# EAGLE design SubBoard_V1 (EAGLE 9.5.2)

## Sheet 1 of 2
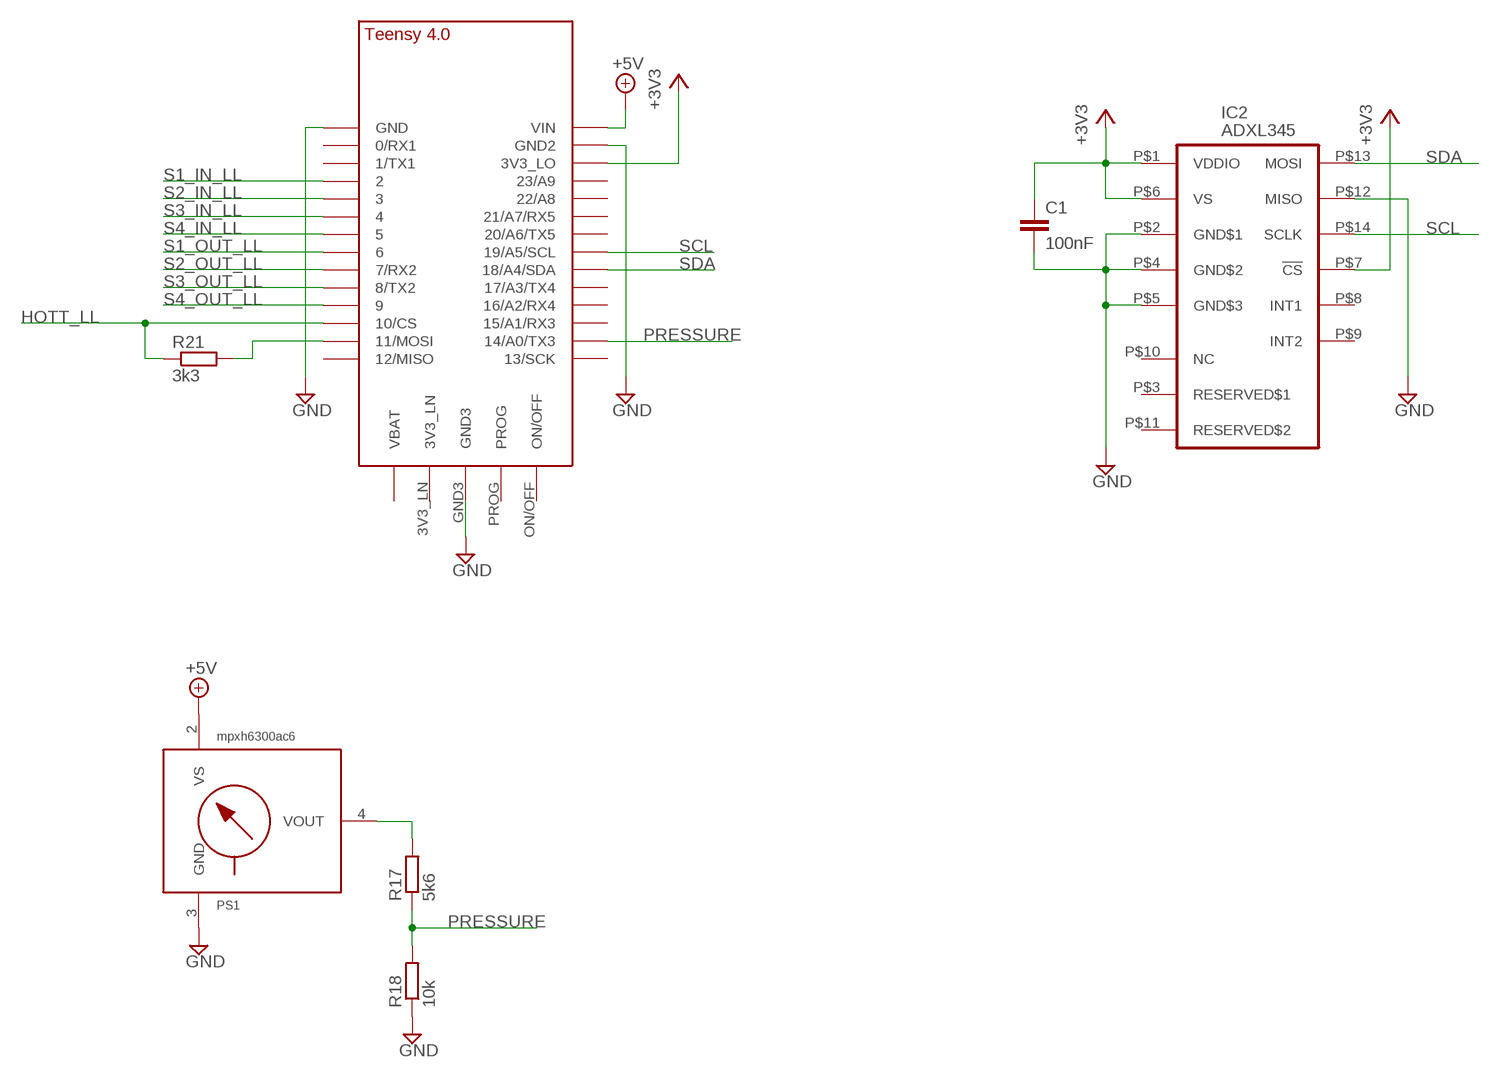
[diagram p0: schematic, sheet 1]

### Parts
C1  100nF  C-EUC0805  [C0805]
IC2  ADXL345  [LGA14]
M1  TEENSY_4.0-BASIC  [TEENSY_4.0-BASIC]
PS1  mpxh6300ac6  MPXV5004GC6U  [482A]
R17  5k6  R-EU_R0805  [R0805]
R18  10k  R-EU_R0805  [R0805]
R21  3k3  R-EU_R0805  [R0805]

### Nets
+3V3: C1.1 IC2.P$1(VDDIO) IC2.P$6(VS) IC2.P$7(!CS) M1.3V3_LO ; also sheet 2
+5V: M1.VIN PS1.2(VS) ; also sheet 2
GND: C1.2 IC2.P$2(GND$1) IC2.P$4(GND$2) IC2.P$5(GND$3) IC2.P$12(MISO) M1.GND M1.GND2 M1.GND3 PS1.3(GND) R18.1 ; also sheet 2
HOTT_LL: M1.10/CS R21.1 ; also sheet 2
N$1: PS1.4(VOUT) R17.2
N$3: M1.11/MOSI R21.2
PRESSURE: M1.14/A0(14/A0/TX3) R17.1 R18.2
S1_IN_LL: M1.2 ; also sheet 2
S1_OUT_LL: M1.6 ; also sheet 2
S2_IN_LL: M1.3/CANTX ; also sheet 2
S2_OUT_LL: M1.7(7/RX2) ; also sheet 2
S3_IN_LL: M1.4/CANRX ; also sheet 2
S3_OUT_LL: M1.8(8/TX2) ; also sheet 2
S4_IN_LL: M1.5 ; also sheet 2
S4_OUT_LL: M1.9/CS ; also sheet 2
SCL: IC2.P$14(SCLK) M1.19/A5/SCL
SDA: IC2.P$13(MOSI) M1.18/A4/SDA
Unconnected: IC2.P$3(RESERVED$1) IC2.P$8(INT1) IC2.P$9(INT2) IC2.P$10(NC) IC2.P$11(RESERVED$2) M1.0/RX(0/RX1) M1.1/TX(1/TX1) M1.3V3_LN M1.12/MISO M1.13/SCK M1.15/A1(15/A1/RX3) M1.16/A2(16/A2/RX4) M1.17/A3(17/A3/TX4) M1.20/A6(20/A6/TX5) M1.21/A7(21/A7/RX5) M1.22/A8 M1.23/A9 M1.ON/OFF M1.PROG M1.VBAT\(VBAT) PS1.1(NC) PS1.5(NC) PS1.6(NC)

## Sheet 2 of 2
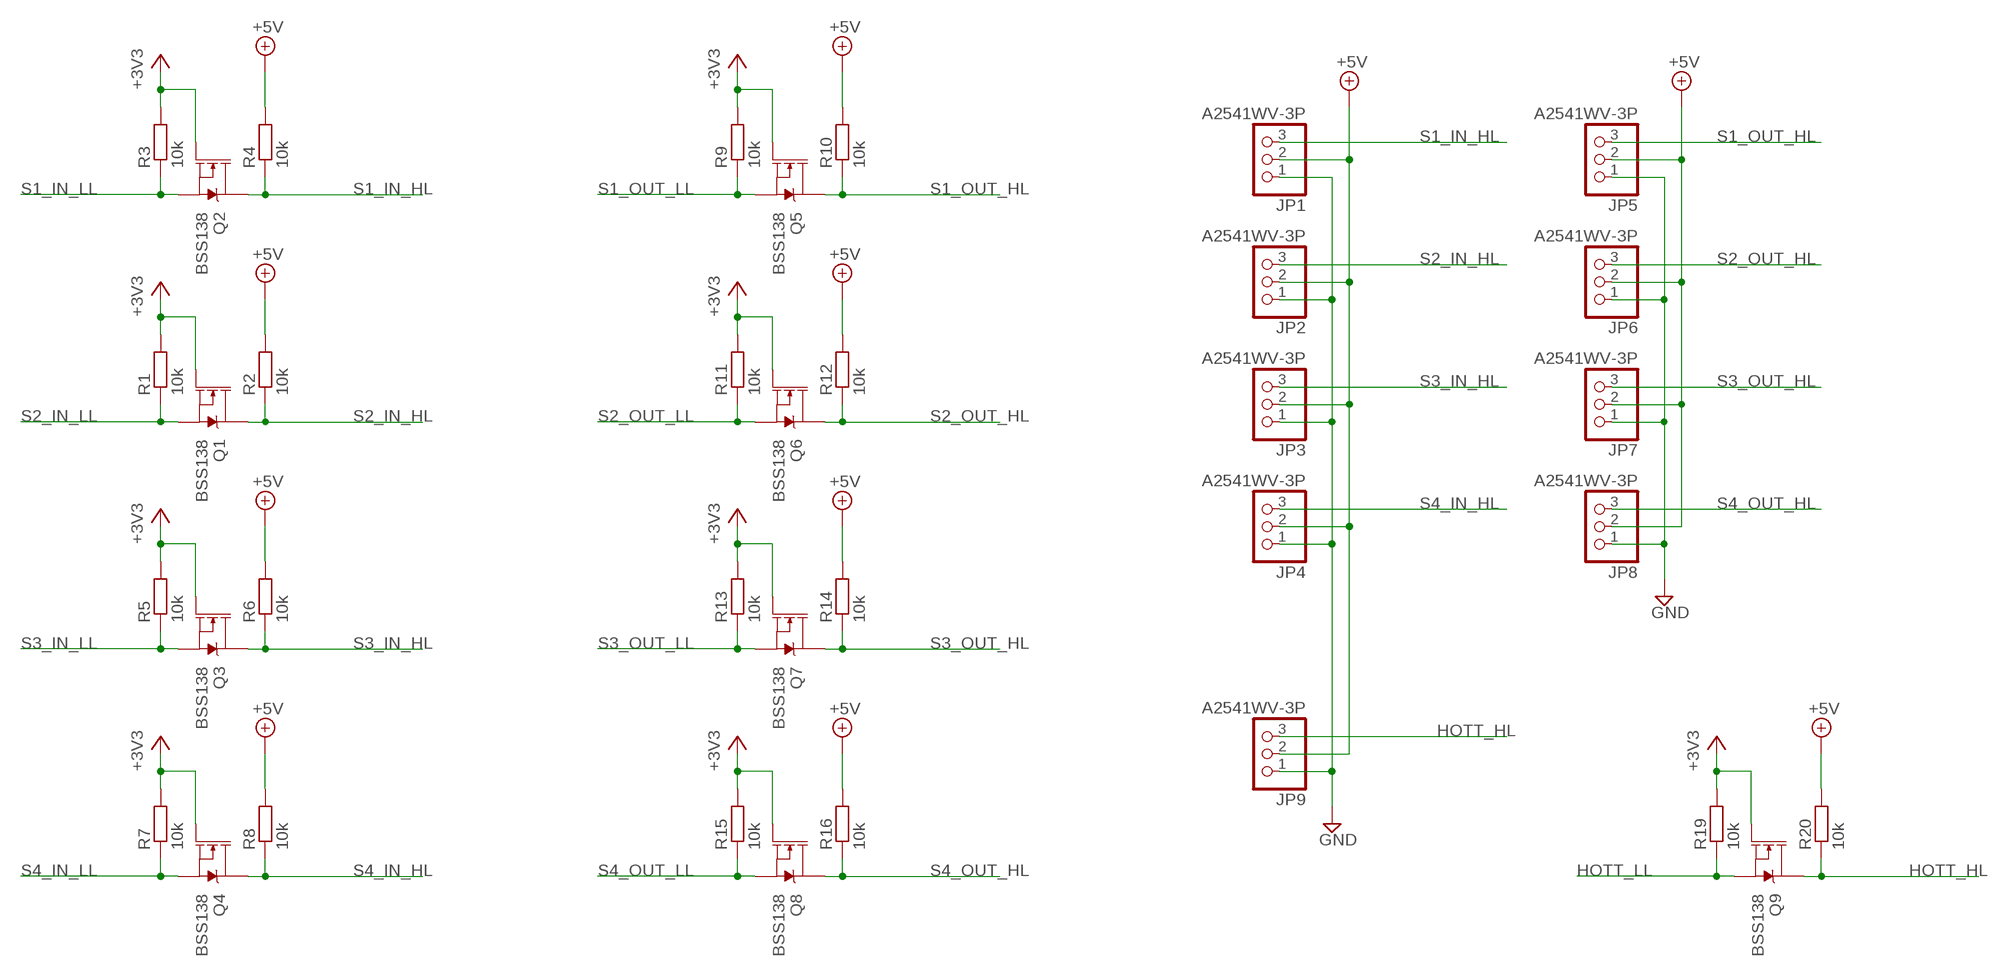
[diagram p1: schematic, sheet 2]

### Parts
JP1  A2541WV-3P  PINHD-1X3  [1X03]
JP2  A2541WV-3P  PINHD-1X3  [1X03]
JP3  A2541WV-3P  PINHD-1X3  [1X03]
JP4  A2541WV-3P  PINHD-1X3  [1X03]
JP5  A2541WV-3P  PINHD-1X3  [1X03]
JP6  A2541WV-3P  PINHD-1X3  [1X03]
JP7  A2541WV-3P  PINHD-1X3  [1X03]
JP8  A2541WV-3P  PINHD-1X3  [1X03]
JP9  A2541WV-3P  PINHD-1X3  [1X03]
Q1  BSS138  MOSFET-NCH-BSS138  [SOT23-3]
Q2  BSS138  MOSFET-NCH-BSS138  [SOT23-3]
Q3  BSS138  MOSFET-NCH-BSS138  [SOT23-3]
Q4  BSS138  MOSFET-NCH-BSS138  [SOT23-3]
Q5  BSS138  MOSFET-NCH-BSS138  [SOT23-3]
Q6  BSS138  MOSFET-NCH-BSS138  [SOT23-3]
Q7  BSS138  MOSFET-NCH-BSS138  [SOT23-3]
Q8  BSS138  MOSFET-NCH-BSS138  [SOT23-3]
Q9  BSS138  MOSFET-NCH-BSS138  [SOT23-3]
R1  10k  R-EU_R0603  [R0603]
R2  10k  R-EU_R0603  [R0603]
R3  10k  R-EU_R0603  [R0603]
R4  10k  R-EU_R0603  [R0603]
R5  10k  R-EU_R0603  [R0603]
R6  10k  R-EU_R0603  [R0603]
R7  10k  R-EU_R0603  [R0603]
R8  10k  R-EU_R0603  [R0603]
R9  10k  R-EU_R0603  [R0603]
R10  10k  R-EU_R0603  [R0603]
R11  10k  R-EU_R0603  [R0603]
R12  10k  R-EU_R0603  [R0603]
R13  10k  R-EU_R0603  [R0603]
R14  10k  R-EU_R0603  [R0603]
R15  10k  R-EU_R0603  [R0603]
R16  10k  R-EU_R0603  [R0603]
R19  10k  R-EU_R0603  [R0603]
R20  10k  R-EU_R0603  [R0603]

### Nets
+3V3: Q1.1(G) Q2.1(G) Q3.1(G) Q4.1(G) Q5.1(G) Q6.1(G) Q7.1(G) Q8.1(G) Q9.1(G) R1.2 R3.2 R5.2 R7.2 R9.2 R11.2 R13.2 R15.2 R19.2 ; also sheet 1
+5V: JP1.2 JP2.2 JP3.2 JP4.2 JP5.2 JP6.2 JP7.2 JP8.2 JP9.2 R2.2 R4.2 R6.2 R8.2 R10.2 R12.2 R14.2 R16.2 R20.2 ; also sheet 1
GND: JP1.1 JP2.1 JP3.1 JP4.1 JP5.1 JP6.1 JP7.1 JP8.1 JP9.1 ; also sheet 1
HOTT_HL: JP9.3 Q9.3(D) R20.1
HOTT_LL: Q9.2(S) R19.1 ; also sheet 1
S1_IN_HL: JP1.3 Q2.3(D) R4.1
S1_IN_LL: Q2.2(S) R3.1 ; also sheet 1
S1_OUT_HL: JP5.3 Q5.3(D) R10.1
S1_OUT_LL: Q5.2(S) R9.1 ; also sheet 1
S2_IN_HL: JP2.3 Q1.3(D) R2.1
S2_IN_LL: Q1.2(S) R1.1 ; also sheet 1
S2_OUT_HL: JP6.3 Q6.3(D) R12.1
S2_OUT_LL: Q6.2(S) R11.1 ; also sheet 1
S3_IN_HL: JP3.3 Q3.3(D) R6.1
S3_IN_LL: Q3.2(S) R5.1 ; also sheet 1
S3_OUT_HL: JP7.3 Q7.3(D) R14.1
S3_OUT_LL: Q7.2(S) R13.1 ; also sheet 1
S4_IN_HL: JP4.3 Q4.3(D) R8.1
S4_IN_LL: Q4.2(S) R7.1 ; also sheet 1
S4_OUT_HL: JP8.3 Q8.3(D) R16.1
S4_OUT_LL: Q8.2(S) R15.1 ; also sheet 1

## Library data of the parts
C1 = rcl:C-EU: CAPACITOR, European symbol; SPICEPREFIX: C
IC2 = adxl345:ADXL345: 3-Axis, ±2 g/±4 g/±8 g/±16 g Digital Accelerometer
JP1-JP9 = pinhead:PINHD-1X3: PIN HEADER
M1 = Teensy-4.0:TEENSY_4.0-BASIC
PS1 = mpx-freescale:MPXV5004G: Integrated Silicon Pressure Sensor On-Chip Signal Conditioned, Temperature Compensated and Calibrated INTEGRATED PRESSURE SENSOR 0 TO 3.92 kPA (0 TO 400 mm H2O) 1.0 TO 4.9 V OUTPUT
Q1-Q9 = SparkFun-DiscreteSemi:MOSFET-NCH: N-channel MOSFETs Voltage controlled devices that allow control of high current outputs. SparkFun Products: SparkFun OpenScale <https://www.sparkfun.com/products/13261> SparkFun Digital Sandbox <https://www.sparkfun.com/products/12651> SparkFun Monster Moto Shield <https://www.sparkfun.com/products/10182> SparkFun MOSFET Power Controller <https://www.sparkfun.com/products/11214>; PROD_ID: TRANS-00830; VALUE: 220mA/50V/3.5Ω
R1-R21 = rcl:R-EU_: RESISTOR, European symbol; SPICEPREFIX: R

## Board
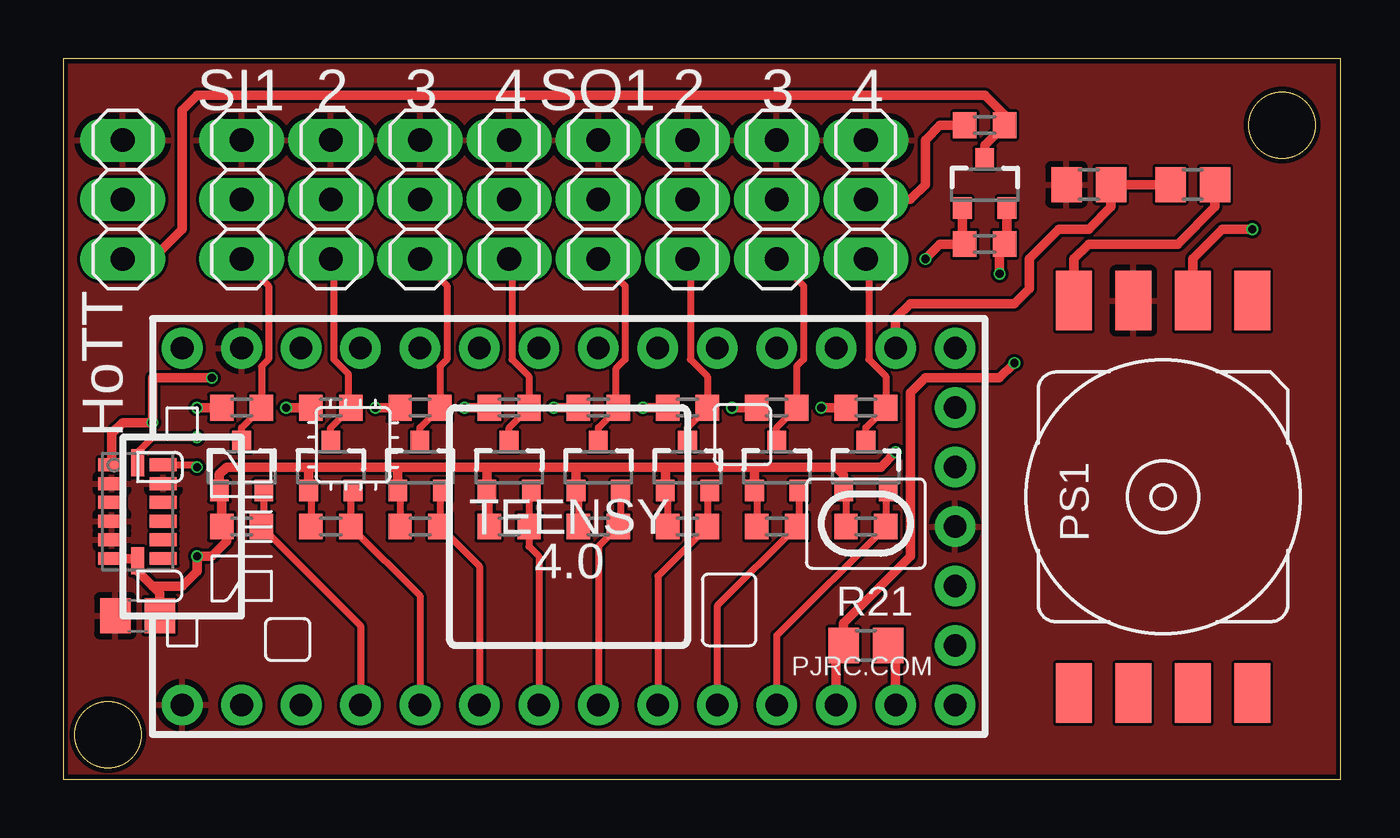
[diagram p2: board, top side]
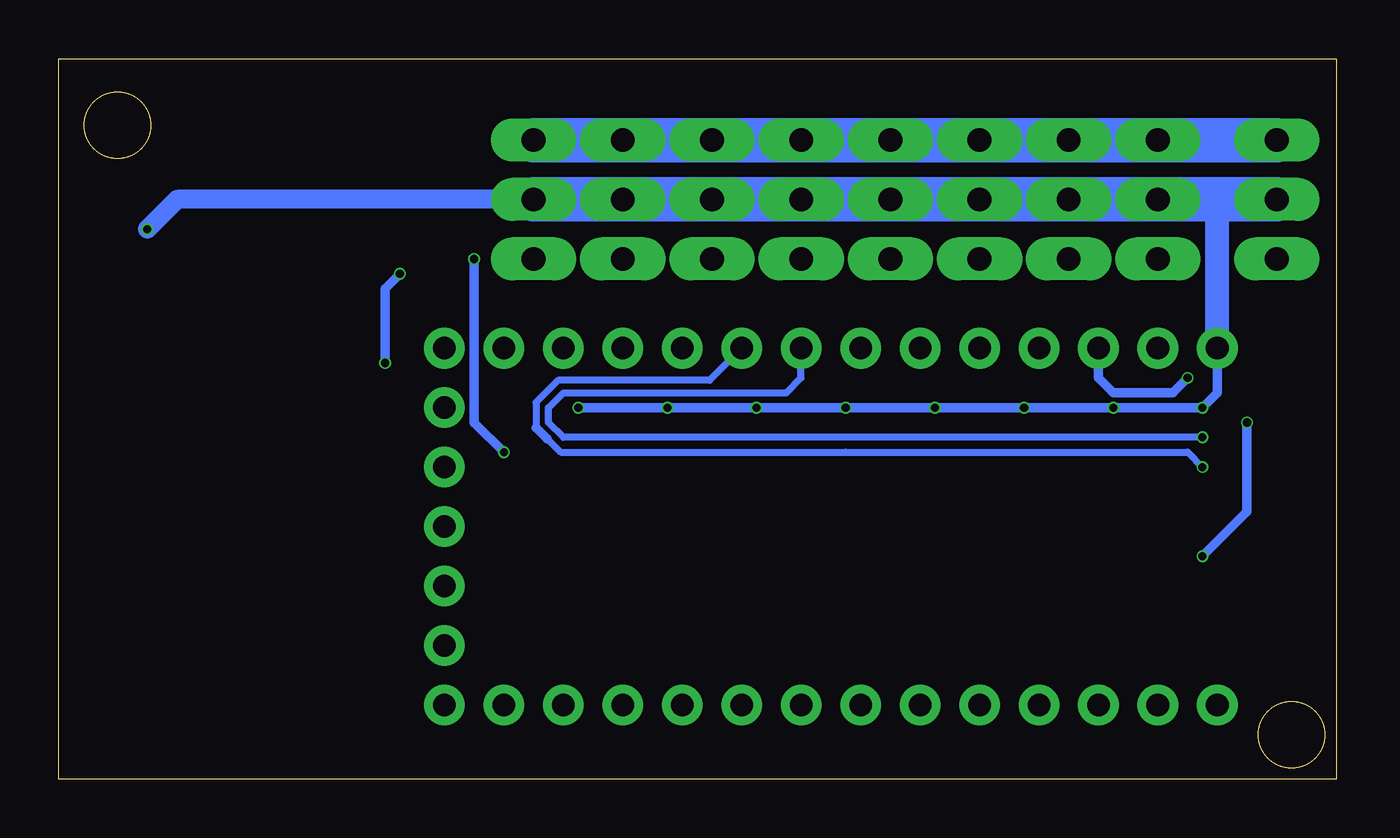
[diagram p3: board, bottom side, seen from below]

Size 54.59 x 30.79 mm. Coordinates in mm from the lower left corner, seen from the top.
Outline: 0,0 54.59,0 54.59,30.79 0,30.79 0,0
Outline: circle at 1.91,1.91 radius 1.42
Outline: circle at 52.07,27.94 radius 1.42
Copper layers (1*16): Top 0.035mm / dielectric 1.6mm / Bottom 0.035mm
Design rules "jlcpcb-2layers": minimum track width 5mil, minimum drill 0.3mm, track to track 5mil, track to pad 5mil, pad to pad 5mil, via to via 5mil, smd to smd 5mil, copper to edge 0.2mm, drill to drill 6mil, minimum pad ring 10mil, minimum via ring 3mil, stop-mask expansion 4mil, vias tented up to drill 0mil, thermal gap 10mil

### Footprints (pad centres in the part's own frame; a part is rotated, then mirrored left to right if it is on the bottom)
C0805 = smd 1.3 x 1.5: 1 -0.95,0; 2 0.95,0
LGA14 = smd 1.15 x 0.55: P$1 -1.1,2; P$2 -1.1,1.2; P$3 -1.1,0.4; P$4 -1.1,-0.4; P$5 -1.1,-1.2; P$6 -1.1,-2; P$8 1.1,-2; P$9 1.1,-1.2; P$10 1.1,-0.4; P$11 1.1,0.4; P$12 1.1,1.2; P$13 1.1,2 | smd 0.55 x 1.15: P$7 0,-2.1; P$14 0,2.1
1X03 = drill 1.016 long: 1 -2.54,0; 2 0,0; 3 2.54,0
TEENSY_4.0-BASIC = drill 0.965: 0/RX -13.97,-7.62; 1/TX -11.43,-7.62; 2 -8.89,-7.62; 3/CANTX -6.35,-7.62; 3V3_LN 16.51,-2.54; 3V3_LO -11.43,7.62; 4/CANRX -3.81,-7.62; 5 -1.27,-7.62; 6 1.27,-7.62; 7 3.81,-7.62; 8 6.35,-7.62; 9/CS 8.89,-7.62; 10/CS 11.43,-7.62; 11/MOSI 13.97,-7.62; 12/MISO 16.51,-7.62; 13/SCK 16.51,7.62; 14/A0 13.97,7.62; 15/A1 11.43,7.62; 16/A2 8.89,7.62; 17/A3 6.35,7.62; 18/A4/SDA 3.81,7.62; 19/A5/SCL 1.27,7.62; 20/A6 -1.27,7.62; 21/A7 -3.81,7.62; 22/A8 -6.35,7.62; 23/A9 -8.89,7.62; GND -16.51,-7.62; GND2 -13.97,7.62; GND3 16.51,0; ON/OFF 16.51,5.08; PROG 16.51,2.54; VBAT\ 16.51,-5.08; VIN -16.51,7.62
482A = smd 2.54 x 1.524: 1 8.382,-3.81; 2 8.382,-1.27; 3 8.382,1.27; 4 8.382,3.81; 5 -8.382,3.81; 6 -8.382,1.27; 7 -8.382,-1.27; 8 -8.382,-3.81
SOT23-3 = smd 0.8 x 0.9: 1 -0.95,-1; 2 0.95,-1; 3 0,1.1
R0603 = smd 1 x 1.1: 1 -0.85,0; 2 0.85,0
R0805 = smd 1.3 x 1.5: 1 -0.95,0; 2 0.95,0

### Placement (x,y rotation side)
C1  3.17,6.99 180 top
IC2  3.17,11.43 0 top
JP1  7.62,24.77 270 top
JP2  11.43,24.77 270 top
JP3  15.24,24.77 270 top
JP4  19.05,24.77 270 top
JP5  22.86,24.77 270 top
JP6  26.67,24.77 270 top
JP7  30.48,24.77 270 top
JP8  34.29,24.77 270 top
JP9  2.54,24.77 270 top
M1  21.59,10.79 0 top
PS1  46.99,12.06 90 top
Q1  11.43,13.34 0 top
Q2  7.62,13.34 0 top
Q3  15.24,13.34 0 top
Q4  19.05,13.34 0 top
Q5  22.86,13.34 0 top
Q6  26.67,13.34 0 top
Q7  30.48,13.34 0 top
Q8  34.29,13.34 0 top
Q9  39.37,25.4 0 top
R1  11.43,10.79 180 top
R2  11.43,15.88 180 top
R3  7.62,10.79 180 top
R4  7.62,15.88 180 top
R5  15.24,10.79 180 top
R6  15.24,15.88 180 top
R7  19.05,10.79 180 top
R8  19.05,15.88 180 top
R9  22.86,10.79 180 top
R10  22.86,15.88 180 top
R11  26.67,10.79 180 top
R12  26.67,15.88 180 top
R13  30.48,10.79 180 top
R14  30.48,15.88 180 top
R15  34.29,10.79 180 top
R16  34.29,15.88 180 top
R17  48.26,25.4 0 top
R18  43.81,25.4 0 top
R19  39.37,22.86 180 top
R20  39.37,27.94 180 top
R21  34.29,5.71 0 top

### Tracks (layer width: path | path; a pad name or v marks a point on that pad's centre or on a via)
+3V3  (via drill 0.35)
  Top 0.305: Q1.1 10.58,12.23 R1.2 | Q3.1 14.39,12.23 R5.2 | Q4.1 18.2,12.23 R7.2 | Q5.1 22.01,12.23 R9.2 | Q6.1 25.82,12.23 R11.2 | Q7.1 29.63,12.23 R13.2 | Q8.1 33.44,12.23 R15.2
  Top 0.406: C1.1 4.12,7.94 3.81,8.26 | 3.81,8.26 3.17,8.89 IC2.P$7 3.08,9.43 IC2.P$6 | 10.48,13.34 6.99,13.34 6.67,13.02 Q2.1 6.77,12.23 R3.2 6.99,10.58 6.99,10.16 6.35,9.53 v5.71,9.53 5.71,8.89 5.08,8.26 3.81,8.26 | 10.48,13.34 14.29,13.34 | 14.29,13.34 18.1,13.34 | 18.1,13.34 21.91,13.34 | 21.91,13.34 25.72,13.34 | 25.72,13.34 29.53,13.34 | 29.53,13.34 33.02,13.34 | 33.02,13.34 33.34,13.02 Q8.1 | Q7.1 29.53,13.34 | Q6.1 25.72,13.34 | Q5.1 21.91,13.34 | Q4.1 18.1,13.34 | Q3.1 14.29,13.34 | Q1.1 10.48,13.34 | v6.35,17.14 3.81,17.14 v3.81,15.24 2.54,15.24 2.08,14.78 IC2.P$1 | Q9.1 38.42,22.96 R19.2 37.47,22.86 v36.83,22.23 | v35.56,13.97 34.92,13.34 33.02,13.34
  Bottom 0.406: M1.3V3_LO 10.16,17.14 9.53,16.51 6.99,16.51 v6.35,17.14 | v3.81,15.24 3.81,11.43 v5.71,9.53 | v36.83,22.23 36.83,15.24 v35.56,13.97
+5V  (via drill 0.35)
  Top 0.406: v32.38,15.88 R16.2 | R14.2 v28.57,15.88 | R12.2 v24.77,15.88 | R10.2 v20.95,15.88 | R8.2 v17.14,15.88 | R6.2 v13.34,15.88 | R2.2 v9.53,15.88 | R4.2 v5.71,15.88 | PS1.2 48.26,22.23 49.53,23.5 v50.8,23.5 | JP8.2 36.2,24.77 36.83,25.4 36.83,27.3 37.47,27.94 R20.2
  Bottom 0.406: M1.VIN 5.08,16.51 v5.71,15.88 v9.53,15.88 v13.34,15.88 v17.14,15.88 v20.95,15.88 v24.77,15.88 v28.57,15.88 v32.38,15.88
  Bottom 0.813: JP8.2 49.53,24.77 v50.8,23.5
  Bottom 1.016: M1.VIN 5.08,24.77
  Bottom 1.905: JP8.2 JP7.2 JP6.2 JP5.2 JP4.2 JP3.2 JP2.2 JP1.2 5.08,24.77 JP9.2
GND
  Bottom 1.905: JP8.1 JP7.1 JP6.1 JP5.1 JP4.1 JP3.1 JP2.1 JP1.1 JP9.1
  pour Top: -0.64,31.11 -0.64,-0.64 53.98,-0.64 55.24,-0.64 55.24,29.84 55.24,31.11
HOTT_HL
  Top 0.406: Q9.3 39.37,27.09 R20.1 40.22,28.36 39.37,29.21 5.71,29.21 5.08,28.57 5.08,23.5 3.81,22.23 JP9.3
HOTT_LL  (via drill 0.35)
  Top 0.406: Q9.2 40.32,22.96 R19.1 40.01,22.64 v40.01,21.59 | M1.10/CS 33.02,5.39 R21.1 33.34,6.67 36.2,9.53 36.2,16.51 36.83,17.14 40.01,17.14 v40.64,17.78
  Bottom 0.406: v40.64,17.78 40.64,20.95 v40.01,21.59
N$1
  Top 0.406: PS1.4 43.18,22.23 43.81,22.86 47.62,22.86 49.21,24.45 R17.2
N$3
  Top 0.406: M1.11/MOSI 35.56,5.39 R21.2
PRESSURE
  Top 0.406: R17.1 R18.2 44.77,24.45 43.81,23.5 42.55,23.5 41.27,22.23 41.27,20.95 40.64,20.32 36.2,20.32 35.56,19.68 M1.14/A0
S1_IN_HL
  Top 0.305: Q2.3 7.62,15.03 R4.1 8.47,17.64 8.77,17.94 8.77,21.08 JP1.3
S1_IN_LL
  Top 0.305: Q2.2 8.57,10.89 R3.1 12.7,6.57 M1.2
S1_OUT_HL
  Top 0.305: Q5.3 22.86,15.03 23.6,15.77 | 23.6,15.77 R10.1 | 23.6,15.77 23.6,17.53 24.01,17.94 24.01,21.08 JP5.3
S1_OUT_LL
  Top 0.305: Q5.2 23.81,10.89 R9.1 22.86,9.95 M1.6
S2_IN_HL
  Top 0.305: Q1.3 11.43,15.03 12.17,15.77 | 12.17,15.77 R2.1 | 12.17,15.77 12.17,17.32 11.55,17.94 11.55,22.1 JP2.3
S2_IN_LL
  Top 0.305: Q1.2 12.28,12.23 R1.1 15.24,7.83 M1.3/CANTX
S2_OUT_HL
  Top 0.305: Q6.3 26.67,15.03 R12.1 27.52,17.21 26.79,17.94 26.79,22.1 JP6.3
S2_OUT_LL
  Top 0.305: Q6.2 27.52,12.23 R11.1 25.4,8.68 M1.7
S3_IN_HL
  Top 0.305: Q3.3 15.24,15.03 R6.1 16.09,17.64 16.39,17.94 16.39,21.08 JP3.3
S3_IN_LL
  Top 0.305: Q3.2 16.09,12.23 R5.1 17.78,9.11 M1.4/CANRX
S3_OUT_HL
  Top 0.305: Q7.3 30.48,15.03 R14.1 31.33,17.64 31.63,17.94 31.63,21.08 JP7.3
S3_OUT_LL
  Top 0.305: Q7.2 31.43,10.89 R13.1 27.94,7.41 M1.8
S4_IN_HL
  Top 0.305: Q4.3 19.05,15.03 R8.1 19.9,17.21 19.17,17.94 19.17,22.1 JP4.3
S4_IN_LL
  Top 0.305: Q4.2 19.9,12.23 R7.1 19.9,9.95 20.32,9.53 M1.5
S4_OUT_HL
  Top 0.305: Q8.3 34.29,15.03 R16.1 35.14,17.21 34.41,17.94 34.41,22.1 JP8.3
S4_OUT_LL
  Top 0.305: Q8.2 35.14,12.23 R15.1 30.48,6.13 M1.9/CS
SCL  (via drill 0.35)
  Top 0.305: IC2.P$14 3.17,13.97 3.81,14.61 v5.71,14.61
  Bottom 0.305: v5.71,14.61 33.02,14.61 33.66,15.24 33.66,15.88 33.02,16.51 23.5,16.51 22.86,17.14 M1.19/A5/SCL
SDA  (via drill 0.35)
  Top 0.305: IC2.P$13 5.62,13.43 v5.71,13.34
  Bottom 0.305: M1.18/A4/SDA 26.77,17.04 33.24,17.04 34.19,16.1 34.19,15.02 | 33.72,14.54 33.14,13.97 20.95,13.97 6.35,13.97 v5.71,13.34
  Bottom 0.406: 34.19,15.02 33.72,14.54

### Text on the board
tPlace: SI1 | 2 | 3 | 4 | SO1 | 2 | 3 | 4 | HoTT